# EAGLE design 20130725_Wave_Clock_PIC32MX130_Mono (EAGLE 7.1.0)
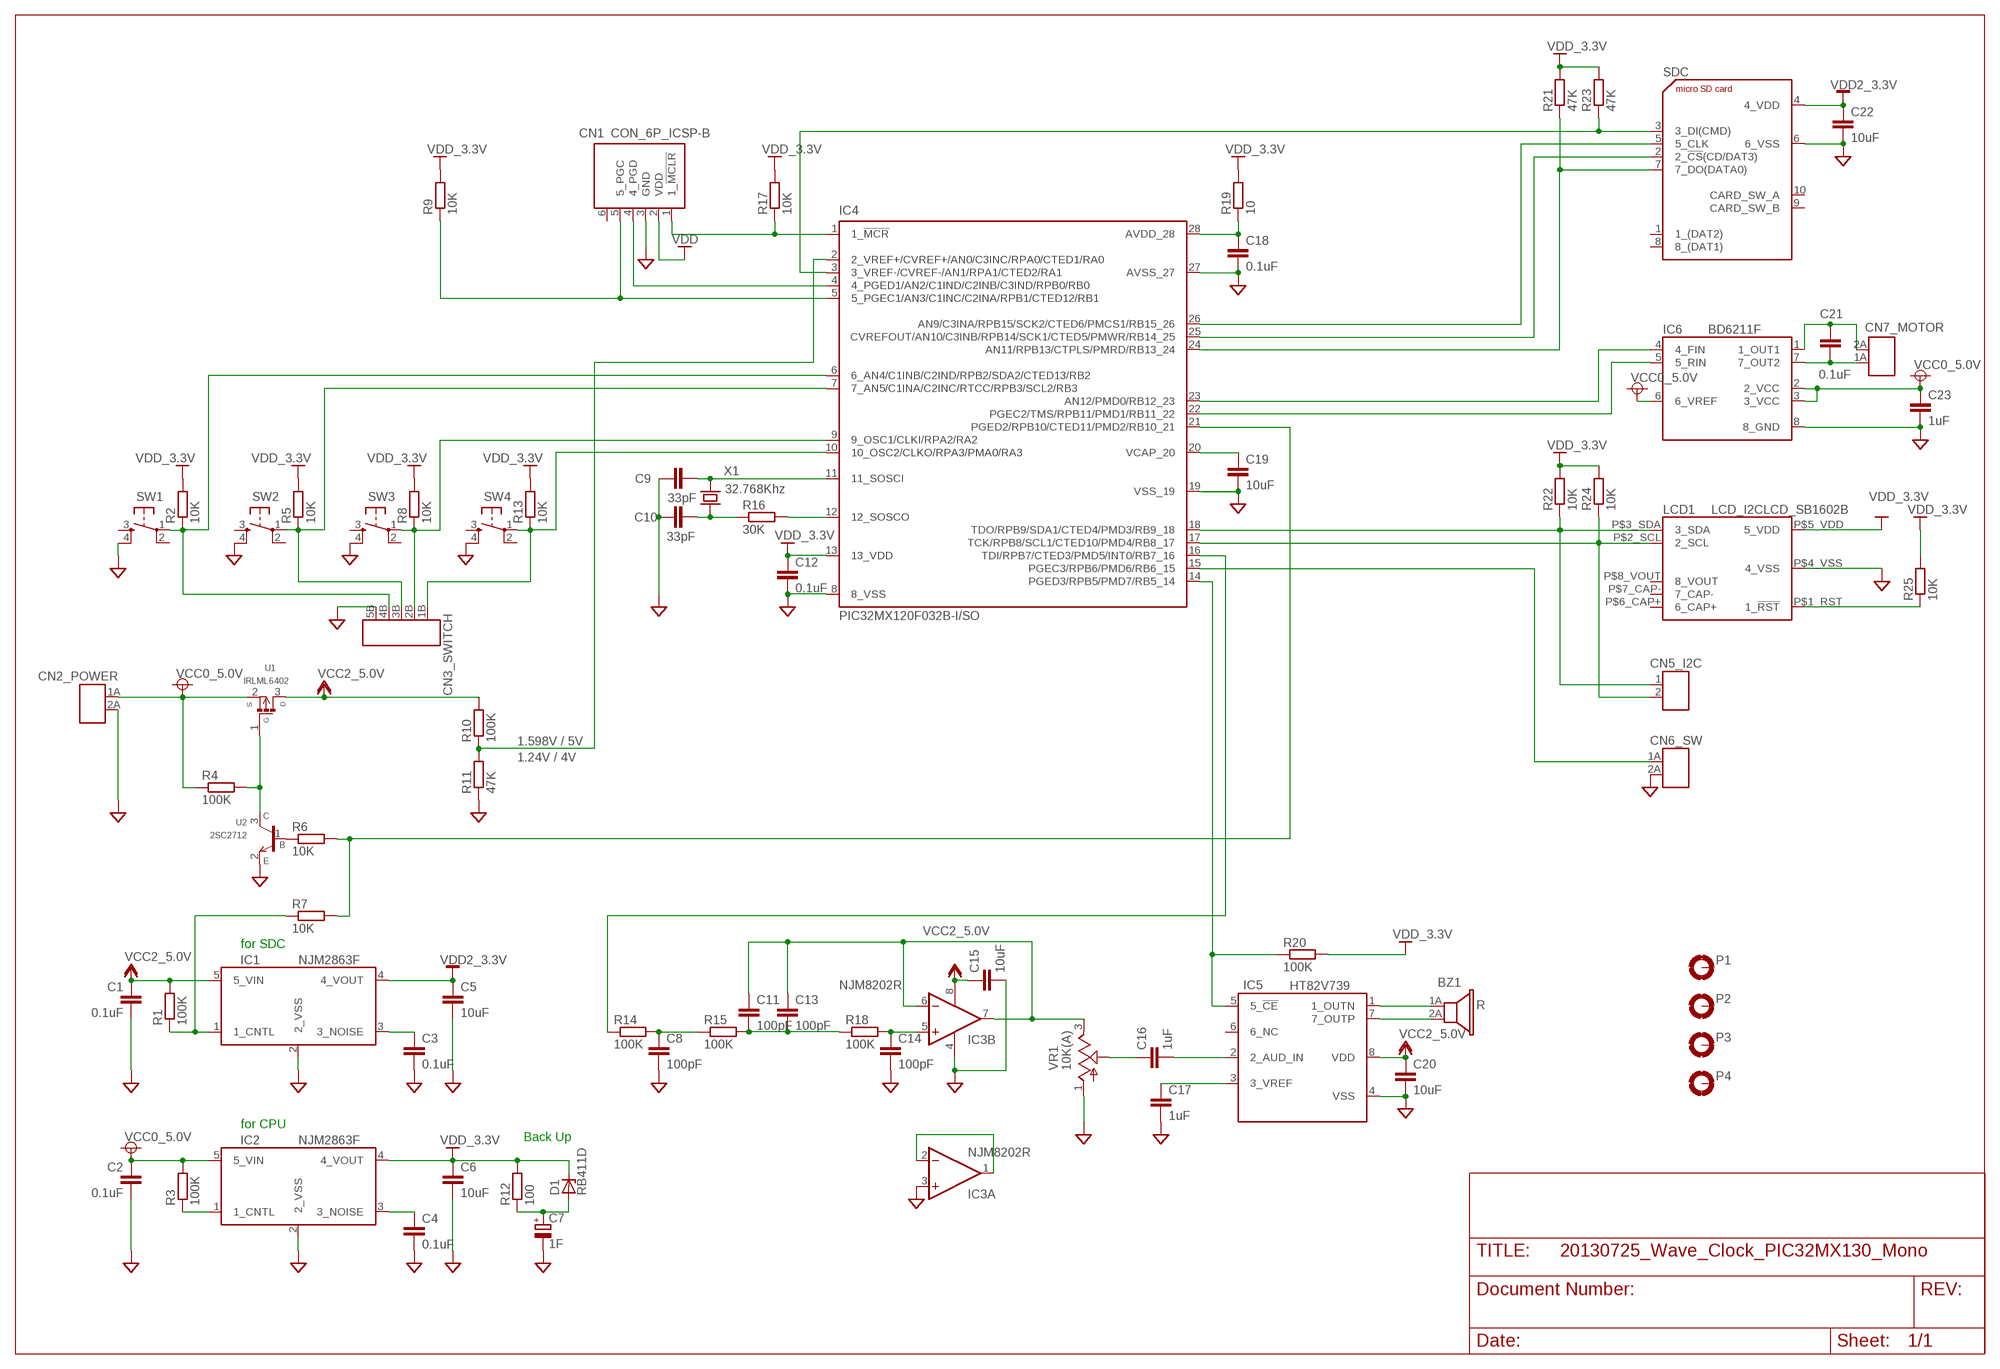
[diagram p0: schematic, sheet 1]

## Parts
BZ1  R  SPEAKER-H  [TERMINAL_AH-2P]
C1  0.1uF  C-EU2M1608  [1608]
C2  0.1uF  C-EU2M1608  [1608]
C3  0.1uF  C-EU2M1608  [1608]
C4  0.1uF  C-EU2M1608  [1608]
C5  10uF  C-EU2M3216  [3216]
C6  10uF  C-EU2M3216  [3216]
C7  1F  CPOL-EDLC-1F5.5V-H  [E5-19V-B]
C8  100pF  C-EU2M1608  [1608]
C9  33pF  C-EU2M1608  [1608]
C10  33pF  C-EU2M1608  [1608]
C11  100pF  C-EU2M1608  [1608]
C12  0.1uF  C-EU2M1608  [1608]
C13  100pF  C-EU2M1608  [1608]
C14  100pF  C-EU2M1608  [1608]
C15  10uF  C-EU2M3216  [3216]
C16  1uF  C-EU2M1608  [1608]
C17  1uF  C-EU2M1608  [1608]
C18  0.1uF  C-EU2M1608  [1608]
C19  10uF  C-EU2M3216  [3216]
C20  10uF  C-EU2M3216  [3216]
C21  0.1uF  C-EU2M1608  [1608]
C22  10uF  C-EU2M3216  [3216]
C23  1uF  C-EU2M1608  [1608]
CN1  CON_6P_ICSP-B  [CON_DIP_6-B]
CN2_POWER  CON_2P-B  CON_2P-H  [TERMINAL_AH-2P]
CN3_SWITCH  CON_5PVR  [TERMINAL_AV-5P]
CN5_I2C  CON_2P-B  [CON_DIP_2-B]
CN6_SW  CON_2P-B  CON_2P-H  [TERMINAL_AH-2P]
CN7_MOTOR  CON_2P-B  CON_2P-H  [TERMINAL_AH-2P]
D1  RB411D  Z_DIODE-SC59  [SOT-23-3-2915-B]
IC1  NJM2863F  [SOT-23-5-2916-B]
IC2  NJM2863F  [SOT-23-5-2916-B]
IC3  NJM8202R  [MSOP08]
IC4  PIC32MX120F032B-I/SO  [SO28W]
IC5  HT82V739  [DIP08-B]
IC6  BD6211F  [SOP8]
LCD1  LCD_I2CLCD_SB1602B  [LCD_SB1602B]
P1  MOUNT-PAD3.3  [PAD-3.3-B]
P2  MOUNT-PAD3.3  [PAD-3.3-B]
P3  MOUNT-PAD3.3  [PAD-3.3-B]
P4  MOUNT-PAD3.3  [PAD-3.3-B]
R1  100K  R-EU2M1608  [1608]
R2  10K  R-EU2M1608  [1608]
R3  100K  R-EU2M1608  [1608]
R4  100K  R-EU2M1608  [1608]
R5  10K  R-EU2M1608  [1608]
R6  10K  R-EU2M1608  [1608]
R7  10K  R-EU2M1608  [1608]
R8  10K  R-EU2M1608  [1608]
R9  10K  R-EU2M1608  [1608]
R10  100K  R-EU2M1608  [1608]
R11  47K  R-EU2M1608  [1608]
R12  100  R-EU2M1608  [1608]
R13  10K  R-EU2M1608  [1608]
R14  100K  R-EU2M1608  [1608]
R15  100K  R-EU2M1608  [1608]
R16  30K  R-EU2M1608  [1608]
R17  10K  R-EU2M1608  [1608]
R18  100K  R-EU2M1608  [1608]
R19  10  R-EU2M1608  [1608]
R20  100K  R-EU2M1608  [1608]
R21  47K  R-EU2M1608  [1608]
R22  10K  R-EU2M1608  [1608]
R23  47K  R-EU2M1608  [1608]
R24  10K  R-EU2M1608  [1608]
R25  10K  R-EU2M1608  [1608]
SDC  DM3AT-SF-PEJＤ  [DM3AT-SF-DIP]
SW1  SW_TACT1  [SW_TACT-B]
SW2  SW_TACT1  [SW_TACT-B]
SW3  SW_TACT1  [SW_TACT-B]
SW4  SW_TACT1  [SW_TACT-B]
U1  IRLML6402  [SC-59-2915]
U2  2SC2712  [SOT-23-3-2915-B]
VR1  10K(A)  POT-VOL  [VOL_MIDDLE]
X1  32.768Khz  XTALVT  [VT-200]

## Nets
GND: C1.2 C2.2 C3.2 C4.2 C5.2 C6.2 C7.- C8.2 C9.2 C10.2 C12.2 C14.2 C15.2 C17.2 C18.2 C19.2 C20.2 C22.2 C23.2 CN1.3(GND) CN2_POWER.2A CN3_SWITCH.5B CN6_SW.2A IC1.2(2_VSS) IC2.2(2_VSS) IC3.3(A:+IN) IC3.4(P:V-) IC4.8(8_VSS) IC4.19(VSS_19) IC4.27(AVSS_27) IC5.4(VSS) IC6.8(8_GND) LCD1.P$4_VSS(4_VSS) R11.1 SDC.6(6_VSS) SW1.4(S1) SW2.4(S1) SW3.4(S1) SW4.4(S1) U2.2(E) VR1.1(A)
N$1: CN1.1(1_!MCLR) IC4.1(1_!MCR) R17.1
N$2: CN1.5(5_PGC) IC4.5(5_PGEC1/AN3/C1INC/C2INA/RPB1/CTED12/RB1) R9.1
N$3: C18.1 IC4.28(AVDD_28) R19.1
N$4: C19.1 IC4.20(VCAP_20)
N$5: IC4.12(12_SOSCO) R16.2
N$6: C9.1 IC4.11(11_SOSCI) X1.P$2
N$7: CN1.4(4_PGD) IC4.4(4_PGED1/AN2/C1IND/C2INB/C3IND/RPB0/RB0)
N$8: CN5_I2C.2 IC4.17(TCK/RPB8/SCL1/CTED10/PMD4/RB8_17) LCD1.P$2_SCL(2_SCL) R24.1
N$9: CN5_I2C.1 IC4.18(TDO/RPB9/SDA1/CTED4/PMD3/RB9_18) LCD1.P$3_SDA(3_SDA) R22.1
N$10: LCD1.P$1_RST(1_!RST) R25.1
N$11: IC4.26(AN9/C3INA/RPB15/SCK2/CTED6/PMCS1/RB15_26) SDC.5(5_CLK)
N$12: IC4.24(AN11/RPB13/CTPLS/PMRD/RB13_24) R21.1 SDC.7(7_DO(DATA0))
N$13: IC4.25(CVREFOUT/AN10/C3INB/RPB14/SCK1/CTED5/PMWR/RB14_25) SDC.2(2_!CS!(CD/DAT3))
N$14: IC4.3(3_VREF-/CVREF-/AN1/RPA1/CTED2/RA1) R23.1 SDC.3(3_DI(CMD))
N$15: CN3_SWITCH.2B IC4.9(9_OSC1/CLKI/RPA2/RA2) R8.1 SW3.1(P)
N$16: IC4.16(TDI/RPB7/CTED3/PMD5/INT0/RB7_16) R14.1
N$18: C14.1 IC3.5(B:+IN) R18.2
N$19: C8.1 R14.2 R15.1
N$20: C11.2 C13.2 R15.2 R18.1
N$25: IC3.1(A:OUT) IC3.2(A:-IN)
N$26: CN6_SW.1A IC4.15(PGEC3/RPB6/PMD6/RB6_15)
N$27: C17.1 IC5.3(3_VREF)
N$28: C16.2 IC5.2(2_AUD_IN)
N$29: BZ1.1A IC5.1(1_OUTN)
N$30: BZ1.2A IC5.7(7_OUTP)
N$31: C10.1 R16.1 X1.P$1
N$32: R6.1 U2.1(B)
N$33: C16.1 VR1.2(S)
N$34: IC1.1(1_CNTL) R1.1 R7.1
N$35: C21.2 CN7_MOTOR.1A IC6.7(7_OUT2)
N$36: C3.1 IC1.3(3_NOISE)
N$37: CN3_SWITCH.3B IC4.7(7_AN5/C1INA/C2INC/RTCC/RPB3/SCL2/RB3) R5.1 SW2.1(P)
N$38: C4.1 IC2.3(3_NOISE)
N$39: IC2.1(1_CNTL) R3.1
N$40: IC4.21(PGED2/RPB10/CTED11/PMD2/RB10_21) R6.2 R7.2
N$41: R4.2 U1.1(G) U2.3(C)
N$42: CN3_SWITCH.4B IC4.6(6_AN4/C1INB/C2IND/RPB2/SDA2/CTED13/RB2) R2.1 SW1.1(P)
N$43: IC4.14(PGED3/RPB5/PMD7/RB5_14) IC5.5(5_!CE) R20.1
N$44: CN3_SWITCH.1B IC4.10(10_OSC2/CLKO/RPA3/PMA0/RA3) R13.1 SW4.1(P)
N$45: C21.1 CN7_MOTOR.2A IC6.1(1_OUT1)
N$49: C11.1 C13.1 IC3.6(B:-IN) IC3.7(B:OUT) VR1.3(E)
N$56: IC4.23(AN12/PMD0/RB12_23) IC6.4(4_FIN)
N$57: IC4.22(PGEC2/TMS/RPB11/PMD1/RB11_22) IC6.5(5_RIN)
N$58: IC4.2(2_VREF+/CVREF+/AN0/C3INC/RPA0/CTED1/RA0) R10.1 R11.2
N$59: C7.+ D1.1(A) R12.1
VCC0: C2.1 C23.1 CN2_POWER.1A IC2.5(5_VIN) IC6.2(2_VCC) IC6.3(3_VCC) IC6.6(6_VREF) R3.2 R4.1 U1.2(S) ; supply symbol labelled VCC0_5.0V
VCC2: C1.1 C15.1 C20.1 IC1.5(5_VIN) IC3.8(P:V+) IC5.8(VDD) R1.2 R10.2 U1.3(D) ; supply symbol labelled VCC2_5.0V
VDD: C6.1 C12.1 CN1.2(VDD) D1.3(C) IC2.4(4_VOUT) IC4.13(13_VDD) LCD1.P$5_VDD(5_VDD) R2.2 R5.2 R8.2 R9.2 R12.2 R13.2 R17.2 R19.2 R20.2 R21.2 R22.2 R23.2 R24.2 R25.2 ; supply symbol labelled VDD_3.3V
VDD2: C5.1 C22.1 IC1.4(4_VOUT) SDC.4(4_VDD) ; supply symbol labelled VDD2_3.3V
Unconnected: CN1.6 IC5.6(6_NC) LCD1.P$6_CAP+(6_CAP+) LCD1.P$7_CAP-(7_CAP-) LCD1.P$8_VOUT(8_VOUT) P1.B2,1(MOUNT) P2.B2,1(MOUNT) P3.B2,1(MOUNT) P4.B2,1(MOUNT) SDC.1(1_(DAT2)) SDC.8(8_(DAT1)) SDC.9(CARD_SW_B) SDC.10(CARD_SW_A) SW1.2(P1) SW1.3(S) SW2.2(P1) SW2.3(S) SW3.2(P1) SW3.3(S) SW4.2(P1) SW4.3(S)

## Notes on the sheet
- 1.598V / 5V
- 1.24V / 4V
- for SDC
- for CPU
- Back Up

## Library data of the parts
BZ1 = p20130601_WaveClock_Pic32MX120:SPEAKER: Speaker
C1-C6 C8-C23 = p20130601_WaveClock_Pic32MX120:C-EU2: CAPACITOR, European symbol
C7 = p20130601_WaveClock_Pic32MX120:CPOL-EDLC: ELNA Electric Double Layer Capacitor DB-5R5D473 T <http://akizukidenshi.com/download/DB-5R5D105T.pdf> 0.047uF 5.5WV
CN1 = p20130601_WaveClock_Pic32MX120:CON_6P_ICSP
CN2_POWER CN5_I2C CN6_SW CN7_MOTOR = p20130601_WaveClock_Pic32MX120:CON_2P: 2P Molex Connector
CN3_SWITCH = p20130601_WaveClock_Pic32MX120:CON_5P
D1 = p20130601_WaveClock_Pic32MX120:Z_DIODE: Z DIODE
IC1 IC2 = p20130601_WaveClock_Pic32MX120:NJM2863: NJM 3.3V series regulator Data Sheet <http://datasheet.sii-ic.com/jp/voltage_regulator/S812C_J.pdf>
IC3 = p20130601_WaveClock_Pic32MX120:NJM8202: OP AMP
IC4 = p20130601_WaveClock_Pic32MX120:PIC32MX120F032B-I/: PIC32MX120 Family Source: Data sheet <http://ww1.microchip.com/downloads/en/DeviceDoc/61168E.pdf>
IC5 = p20130601_WaveClock_Pic32MX120:HT82V739
IC6 = p20130601_WaveClock_Pic32MX120:BD6211: ROHM H-bridge Motor Driver (7V max.) These H-bridge drivers are full bridge drivers for brush motor applications.
LCD1 = p20130601_WaveClock_Pic32MX120:LCD_I2CLCD
P1-P4 = p20130601_WaveClock_Pic32MX120:MOUNT-PAD: 2.1mm Mount Pad (Connectable to GND)
R1-R25 = p20130601_WaveClock_Pic32MX120:R-EU2: RESISTOR, European symbol
SDC = p20130601_WaveClock_Pic32MX120:DM3AT-SF-PEJ: DM3AT-SF-PEJ DM3AT series , microSD card socket Producted by Hirose(HRS).Co CC : card check (closed at insert ; short CC1 and CC2)
SW1-SW4 = p20130601_WaveClock_Pic32MX120:SW_TACT: Tacticle Push Switch
U1 = p20130601_WaveClock_Pic32MX120:IRLML6402: International Rectifier Field Effect Transistor Silicon P Channel MOS IRLML64026402 <http://www.irf.com/product-info/datasheets/data/irlml6402.pdf> VDS=-20V RON=50m¶(VGS=-4.5V) ID=-3.7A
U2 = p20130601_WaveClock_Pic32MX120:2SC2712: TOSHIBA Silicon NPN Tripple Siffused Type ( PCT process) High Voltage Control Applications 2SC2712 <http://www.toshiba.com/taec/components2/Datasheet_Sync/50/6545.pdf> VCEO=50V IC=100mA hFE=120-240
VR1 = p20130601_WaveClock_Pic32MX120:POT: Volume Trimmer Resister
X1 = p20130601_WaveClock_Pic32MX120:XTAL: Crystal Oscillator HC49U/S

## Net classes
1 VCC0: width 0.762 mm
2 VCC2: width 0.508 mm
3 VDD0: width 0.508 mm
4 VDD2: width 0.508 mm

## Board
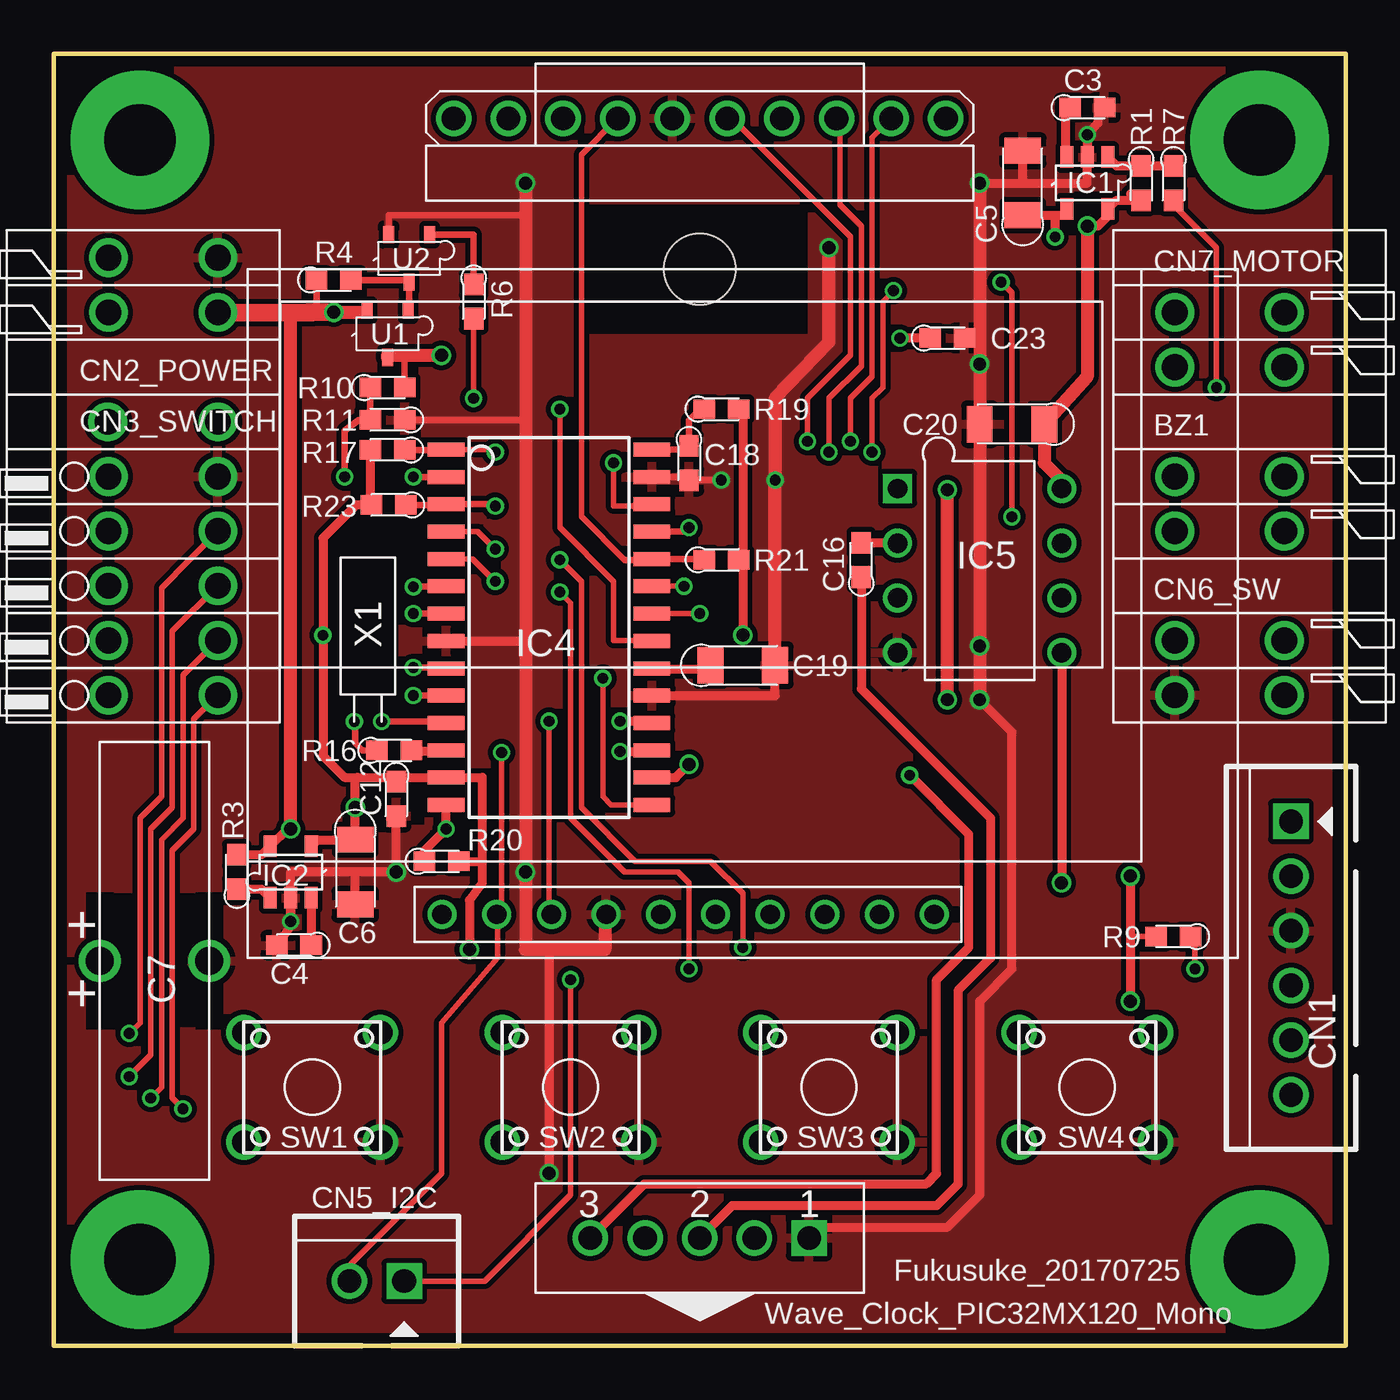
[diagram p1: board, top side]
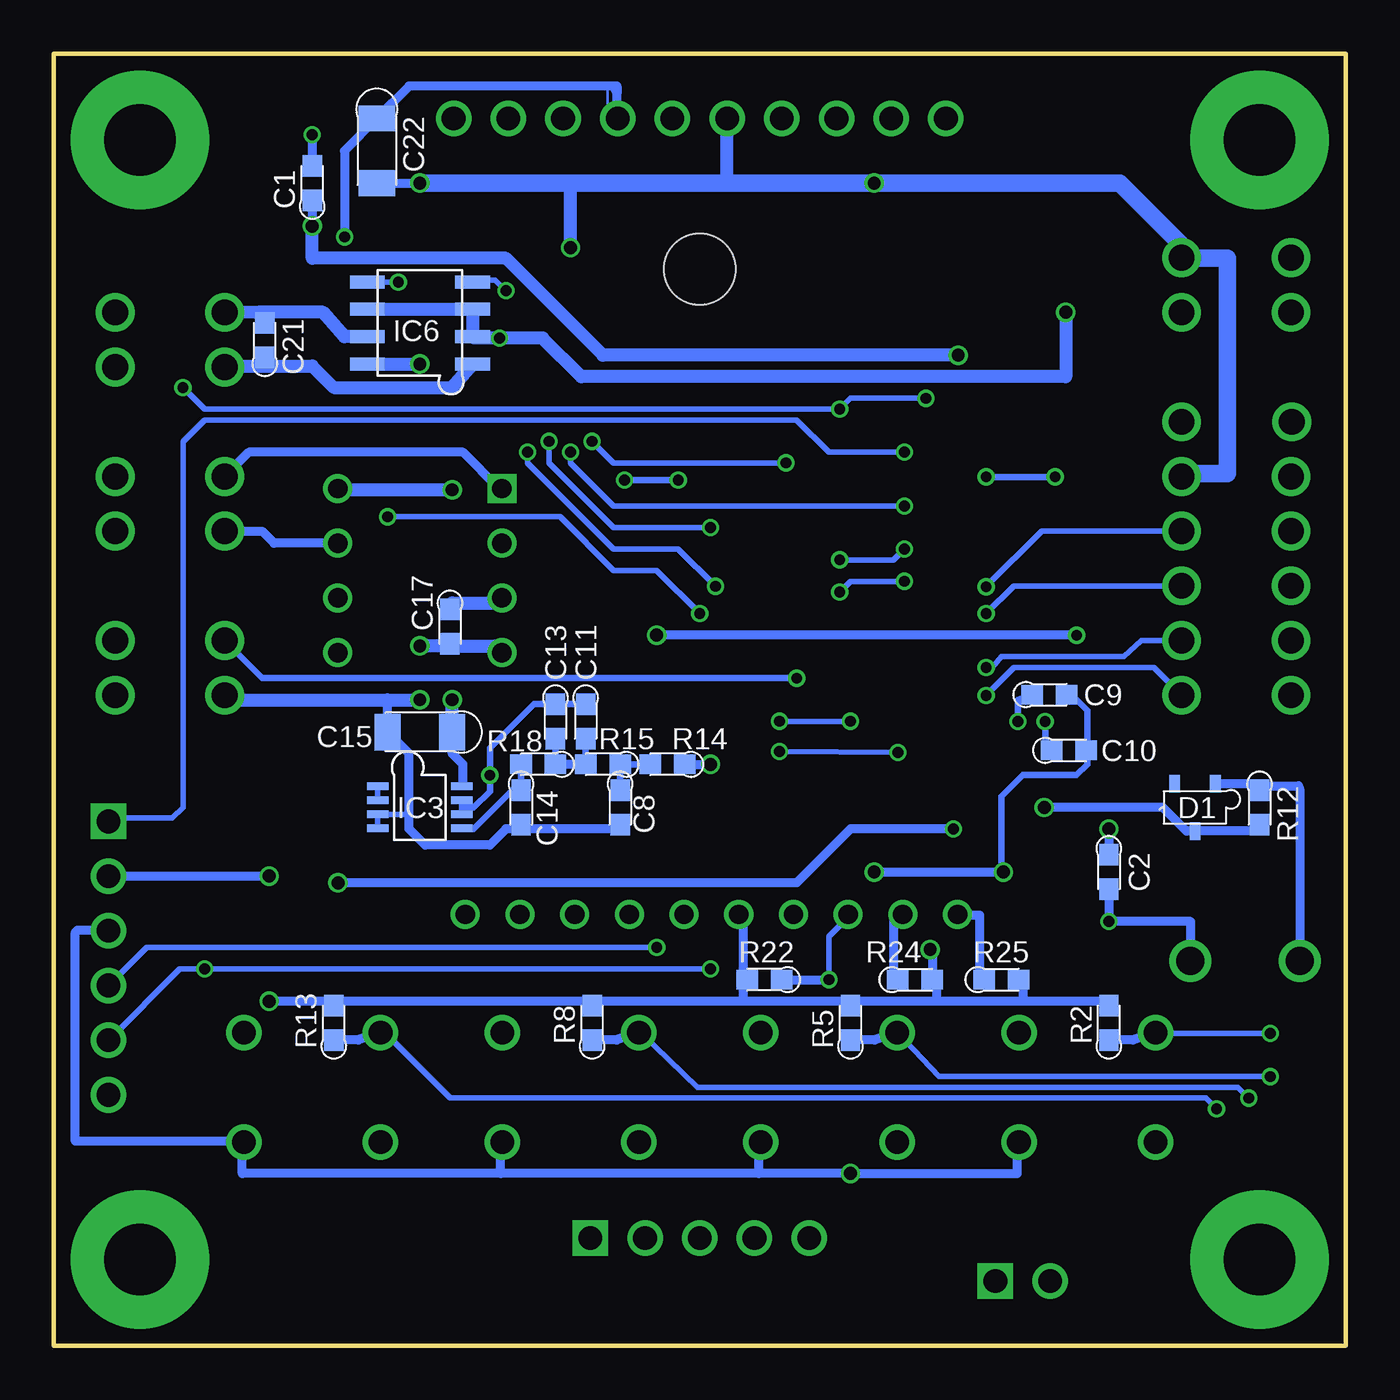
[diagram p2: board, bottom side, seen from below]

Size 60 x 60 mm. Coordinates in mm from the lower left corner, seen from the top.
Outline: 0,0 60,0 60,60 0,60 0,0
Copper layers (1*16): Top 0.035mm / dielectric 1.53mm / Bottom 0.035mm
Design rules "pban_5mil-l2 *": minimum track width 5mil, minimum drill 0.3mm, track to track 0.229mm, track to pad 0.229mm, pad to pad 0.229mm, via to via 0.229mm, smd to smd 5mil, copper to edge 0.5mm, drill to drill 0.5mm, minimum pad ring 0.15mm, minimum via ring 0.15mm, stop-mask expansion 4mil, vias tented up to drill 0.35mm, thermal gap 10mil
Holes 3.3 mm at 30,50
tRestrict: area 25,47 to 35,53; area 13,30 to 16,37; area 15.1,51.2 to 15.3,52; area 15.1,51 to 16,51.2; area 15.8,51.2 to 16,52; area 14.5,24.2 to 15.4,26; area 16.6,24.2 to 17.2,26; area 3.2,15.2 to 3.6,21; area 5.8,14.8 to 6.2,21; area 2.8,18.8 to 3.2,21; area 6.2,18.8 to 6.6,21; area 6.2,14.8 to 6.6,17; 4 more areas
bRestrict: area 27,47 to 33,53

### Footprints (pad centres in the part's own frame; a part is rotated, then mirrored left to right if it is on the bottom)
TERMINAL_AH-2P = drill 1.2: 1A 0,0; 1B 0,5.08; 2A 2.54,0; 2B 2.54,5.08
1608 = smd 1 x 0.9: 1 -0.8,0; 2 0.8,0
3216 = smd 1.2 x 1.7: 1 -1.5,0; 2 1.5,0
E5-19V-B = drill 1.3: + 0,2.54; - 0,-2.54
CON_DIP_6-B = drill 1.1 square: 1 -6.35,0 | drill 1.1: 2 -3.81,0; 3 -1.27,0; 4 1.27,0; 5 3.81,0; 6 6.35,0
TERMINAL_AV-5P = drill 1.2: 1A 0,5.08; 1B 0,0; 2A 2.54,5.08; 2B 2.54,0; 3A 5.08,5.08; 3B 5.08,0; 4A 7.62,5.08; 4B 7.62,0; 5A 10.16,5.08; 5B 10.16,0
CON_DIP_2-B = drill 1.1 square: 1 -1.27,0 | drill 1.1: 2 1.27,0
SOT-23-3-2915-B = smd 0.5 x 0.8: 1 -0.95,-1.1; 2 0.95,-1.1; 3 0,1.1
SOT-23-5-2916-B = smd 0.6 x 1: 1 -0.95,-1.2; 2 0,-1.2; 3 0.95,-1.2; 4 0.95,1.2; 5 -0.95,1.2
MSOP08 = smd 0.35 x 1: 1 -0.975,-1.95; 2 -0.325,-1.95; 3 0.325,-1.95; 4 0.975,-1.95; 5 0.975,1.95; 6 0.325,1.95; 7 -0.325,1.95; 8 -0.975,1.95
SO28W = smd 0.65 x 1.7: 1 -7.62,-4.78; 2 -6.35,-4.78; 3 -5.08,-4.78; 4 -3.81,-4.78; 5 -2.54,-4.78; 6 -1.27,-4.78; 7 0,-4.78; 8 1.27,-4.78; 9 2.54,-4.78; 10 3.81,-4.78; 11 5.08,-4.78; 12 6.35,-4.78; 13 7.62,-4.78; 14 8.89,-4.78; 15 8.89,4.78; 16 7.62,4.78; 17 6.35,4.78; 18 5.08,4.78; 19 3.81,4.78; 20 2.54,4.78; 21 1.27,4.78; 22 0,4.78; 23 -1.27,4.78; 24 -2.54,4.78; 25 -3.81,4.78; 26 -5.08,4.78; 27 -6.35,4.78; 28 -7.62,4.78
DIP08-B = drill 0.9 square: 1 -3.81,-3.81 | drill 0.9: 2 -1.27,-3.81; 3 1.27,-3.81; 4 3.81,-3.81; 5 3.81,3.81; 6 1.27,3.81; 7 -1.27,3.81; 8 -3.81,3.81
SOP8 = smd 0.6 x 1.62: 1 -1.905,-2.44; 2 -0.635,-2.44; 3 0.635,-2.44; 4 1.905,-2.44; 5 1.905,2.44; 6 0.635,2.44; 7 -0.635,2.44; 8 -1.905,2.44
LCD_SB1602B = drill 0.9: P$1_RST -13.97,-13.97; P$2_SCL -11.43,-13.97; P$3_SDA -8.89,-13.97; P$4_VSS -6.35,-13.97; P$5_VDD -3.81,-13.97; P$6_CAP+ -1.27,-13.97; P$7_CAP- 1.27,-13.97; P$8_VOUT 3.81,-13.97; P$9_LED_A 6.35,-13.97; P$10_LED_K 8.89,-13.97
PAD-3.3-B = drill 3.3 pad 6.452: B2,1 0,0
DM3AT-SF-DIP = drill 1.1: 1 11.43,0; 2 8.89,0; 3 6.35,0; 4 3.81,0; 5 1.27,0; 6 -1.27,0; 7 -3.81,0; 8 -6.35,0; 9 -8.89,0; 10 -11.43,0
SW_TACT-B = drill 1.1: 1 -3.175,2.54; 2 3.175,2.54; 3 -3.175,-2.54; 4 3.175,-2.54
SC-59-2915 = smd 0.5 x 0.8: 1 -0.95,-1.1; 2 0.95,-1.1; 3 0,1.1
VOL_MIDDLE = drill 1.1 square: 1 -5.08,0 | drill 1.1: 2 0,0; 3 5.08,0; NC4 -2.54,0; NC5 2.54,0
VT-200 = drill 0.5: P$1 -0.635,-4.445; P$2 0.635,-4.445

### Placement (x,y rotation side)
BZ1  52.07,40.37 270 top
C1  48,54 90 bottom
C2  11,22 270 bottom
C3  48,57.5 0 top
C4  11.15,18.6 180 top
C5  45,54 90 top
C6  14,22 270 top
C7  4.68,17.87 90 top
C8  33.7,25 270 bottom
C9  13.77,30.24 0 bottom
C10  12.86,27.65 0 bottom
C11  35.3,29 270 bottom
C12  15.9,25.4 270 top
C13  36.7,29 270 bottom
C14  38.3,25 270 bottom
C15  43,28.5 180 bottom
C16  37.5,36.5 90 top
C17  41.6,33.4 270 bottom
C18  29.5,41 270 top
C19  32,31.6 0 top
C20  44.5,42.8 180 top
C21  50.2,46.7 90 bottom
C22  45,55.5 270 bottom
C23  41.5,46.8 0 top
CN1  57.46,18 270 top
CN2_POWER  7.62,47.99 90 top
CN3_SWITCH  7.62,30.21 90 top
CN5_I2C  15,3 180 top
CN6_SW  52.07,32.75 270 top
CN7_MOTOR  52.07,47.99 270 top
D1  7,25 180 bottom
IC1  48,54 180 top
IC2  11,22 0 top
IC3  43,25 270 bottom
IC4  23,34 270 top
IC5  43,36 270 top
IC6  43,47.5 90 bottom
LCD1  32,34 0 top
P1  4,4 0 top
P2  56,4 0 top
P3  56,56 0 top
P4  4,56 0 top
R1  50.5,54 270 top
R2  11,15 90 bottom
R3  8.5,22 90 top
R4  13,49.5 0 top
R5  23,15 90 bottom
R6  19.5,48.5 270 top
R7  52,54 270 top
R8  35,15 90 bottom
R9  52,19 180 top
R10  15.5,44.5 0 top
R11  15.5,43 180 top
R12  4,25 270 bottom
R13  47,15 90 bottom
R14  31.5,27 180 bottom
R15  34.5,27 180 bottom
R16  15.8,27.65 0 top
R17  15.5,41.6 180 top
R18  37.5,27 180 bottom
R19  31,43.5 0 top
R20  18,22.5 0 top
R21  31,36.5 0 top
R22  27,17 180 bottom
R23  15.55,39.05 180 top
R24  20,17 0 bottom
R25  16,17 0 bottom
SDC  30,57 0 top
SW1  12,12 0 top
SW2  24,12 0 top
SW3  36,12 0 top
SW4  48,12 0 top
U1  15.5,47 180 top
U2  16.5,50.5 180 top
VR1  30,5 180 top
X1  14.59,33.43 0 top

### Tracks (layer width: path | path; a pad name or v marks a point on that pad's centre or on a via)
GND  (via drill 0.5, 0.6)
  Top 0.305: v31,40.2 C18.2 29.35,40.35 IC4.27 | U2.2 15.55,52.5 21.9,52.5 | R11.1 21.9,43
  Top 0.406: 48,56.2 IC1.2 | C22.2 48,54 48,55 | v48,56.25 48.5,56.8 48.5,57.5 C3.2 | v43,54 C22.2 | C22.2 C5.2 | 21.9,32.7 18.3,32.7 | 23,18.4 v23,8 | 25.6,20 LCD1.P$4_VSS | IC2.2 v11,19.7 | v11,19.7 11,19.5 C4.2 | C6.2 14,22 | 14,22 11,22 v11,19.7 | 14,22 v15.9,22 C12.2 | C23.2 42.7,46.8 43,46.5 | VR1.1 35.08,5.08 35.5,5.5 41.5,5.5 43,7 43,16 44.5,17.5 C15.2 v43,30 | IC4.19 33.5,30.19 C19.2
  Top 0.61: v43,54 43,46.5 v43,45.59 C20.2 v43,32.5 v43,30 | v36,51 36,46.6 33.5,44 v33.5,40.2 C19.2 | v21.9,54 21.9,52.5 21.9,43 21.9,32.7 v21.9,22 21.9,18.4 23,18.4 25.6,18.4 25.6,20
  Bottom 0.254: IC3.4 IC3.3 43.5,24.68 43.5,24.5
  Bottom 0.305: v31,40.2 v33.5,40.2 | 12,27.65 12,27 12.5,26.5 15,26.5 16,25.5 16,22.1 | C9.2 12.74,30.24 12,29.5 12,27.71 C10.2
  Bottom 0.406: 7.7,50.5 CN2_POWER.2A | 28.75,56.9 SDC.6 | v48,56.25 C1.2 | 41.5,32.5 C17.2 | 52,30 CN6_SW.2A | C14.2 38.3,24 | 27.25,8 v23,8 15.25,8 15.25,9.25 SW1.4 | 27.25,8 39.25,8 | 39.25,8 51.25,8 51.25,9.5 | 27.25,8 27.25,9.25 SW2.4 | 39.25,8 39.25,9.25 SW3.4 | 51.25,9.5 SW4.4 | C2.2 v11,19.7 7.2,19.7 7.2,17.89 C7.- | 22,22 v15.9,22 16,22.1 | 33.7,24.1 C8.2 33.8,24.2 34,24 38.1,24 C14.2 | 44.5,30 C15.2 43.5,27.5 43.5,24.5 43.5,24 42.75,23.25 39.75,23.25 39,24 38.5,24 C14.2 | 51.25,9.5 59,9.5 59,19.2 58.9,19.3 57.49,19.3 CN1.3 | C10.2 12,27.65 | C22.2 v43,54
  Bottom 0.61: 28.75,56.9 28.75,54 | v36,51 36,54 | v43,32.5 41.5,32.5 39.5,32.5 IC5.4 | 52,30 44.5,30 v43,30 | IC6.8 v43,45.59
  Bottom 0.813: v43,54 36,54 28.75,54 v21.9,54 10.5,54 7.7,51.2 7.7,50.5 5.5,50.5 5.5,40.5 7.62,40.5 CN3_SWITCH.5B
  pour Top: 0,60 60,60 60,0 0,0
N$1  (via drill 0.5)
  Top 0.254: IC4.1 20.38,41.62 v20.5,41.5
  Top 0.305: R17.1 18.2,41.6 IC4.1
  Bottom 0.254: v20.5,41.5 24,41.5 25.5,43 53,43 54,42 54,25 54.5,24.5 57.31,24.5 CN1.1
N$2  (via drill 0.5)
  Top 0.254: IC4.5 19.46,36.54 v20.5,35.5 | v23.5,35 24,34.5 24,24.5 26.5,22 29,22 29.5,21.5 v29.5,17.5 | R9.1 53,19 v53,17.5
  Bottom 0.254: v20.5,35.5 23,35.5 v23.5,35 | v29.5,17.5 v53,17.5 54.15,17.5 CN1.5
N$3
  Top 0.305: 29.3,41.62 IC4.28 | R19.1 30,43.5 29.5,43 C18.1
  Top 0.406: 29.3,41.62 C18.1
N$4
  Top 0.406: IC4.20 27.8,31.4 30.6,31.4 30.6,31.6 C19.1
N$5
  Top 0.406: R16.2 16.6,27.6 18.2,27.6 IC4.12
N$6
  Top 0.305: X1.P$2 15.4,29 18.2,29
  Top 0.406: 18.2,29 IC4.11
  Bottom 0.305: C9.1 15.22,30 X1.P$2
N$7  (via drill 0.5)
  Top 0.254: IC4.4 19.69,37.81 v20.5,37 | v23.5,36.5 24.5,35.5 24.5,25 27,22.5 30.5,22.5 32,21 v32,18.5
  Bottom 0.254: v20.5,37 21,36.5 v23.5,36.5 | v32,18.5 55.69,18.5 CN1.4
N$8  (via drill 0.5)
  Top 0.254: v20.8,27.55 20.8,20.65 20.6,20.45 20.6,20.1 20.6,18 18,15 18,8 13.8,3.8 CN5_I2C.2 | IC4.17 27.78,27.62 27.8,27.6
  Top 0.406: v26.3,27.6 27.8,27.6 | 20.6,20.1 LCD1.P$2_SCL
  Bottom 0.254: v20.8,27.55 v26.3,27.6
  Bottom 0.406: LCD1.P$2_SCL 21,20 21,17 R24.1
N$9  (via drill 0.5)
  Top 0.254: 23,20 v23,29 | v24,17 24,7 20,3 CN5_I2C.1
  Top 0.406: 23,20 LCD1.P$3_SDA | v26.3,29 27,29 IC4.18
  Bottom 0.254: v24,17 24,19 23,20 | v23,29 v26.3,29
  Bottom 0.406: 23,20 LCD1.P$3_SDA | R22.1 v24,17
N$10
  Bottom 0.406: LCD1.P$1_RST 18,20 17,20 17,17 R25.1
N$11  (via drill 0.5)
  Top 0.254: 26.92,39 26,39 v26,41 | v35,42 35,44 37,46 37,51.5 32,56.5
  Top 0.305: IC4.26 26.92,39 | 32,56.5 31.5,57 SDC.5
  Bottom 0.254: v26,41 34,41 v35,42
N$12
  Top 0.254: 26.5,36.5 24.5,38.5 24.5,55.31 SDC.7
  Top 0.305: R21.1 30.2,36.54 IC4.24 27.5,36.5 26.5,36.5
N$13  (via drill 0.5)
  Top 0.254: v37,42 37,44 38,45 38,56.11 SDC.2
  Top 0.305: IC4.25 29.31,37.81 v29.5,38
  Bottom 0.254: v29.5,38 34,38 37,41 v37,42
N$14  (via drill 0.5)
  Top 0.254: v36,41.5 36,44 37.5,45.5 37.5,52 36.5,53 36.5,56.85
  Top 0.305: R23.1 18.19,39.05 IC4.3 20.42,39.08 v20.5,39 | 36.5,56.85 SDC.3
  Bottom 0.254: v20.5,39 34,39 36,41 v36,41.5
N$15  (via drill 0.5)
  Top 0.254: CN3_SWITCH.2B 6,31.15 6,24.5 5,23.5 5,12 v4.5,11.5
  Top 0.305: v16.7,31.5 18.18,31.5 IC4.9
  Bottom 0.254: 32.74,14.54 30.1,12 5,12 v4.5,11.5 | CN3_SWITCH.2B 9.5,32.75 10.3,32 16,32 16.4,31.5 v16.7,31.5
  Bottom 0.305: SW3.1 32.74,14.54
  Bottom 0.406: SW3.1 33.87,14.2 R8.1
N$16  (via drill 0.6)
  Top 0.406: IC4.16 28.88,26.38 v29.5,27
  Bottom 0.406: R14.1 v29.5,27
N$17  (via drill 1.2)
  other vias: 7.62,42.91
N$18
  Bottom 0.305: R18.2 C14.1 38.7,25.8 40.5,24 41.02,24 IC3.5
N$19
  Bottom 0.305: R14.2 R15.1 C8.1
N$20
  Bottom 0.305: C11.2 R15.2 | C13.2 R18.1
  Bottom 0.406: R15.2 R18.1
N$21  (via drill 1.2)
  other vias: 2.5,42.91
N$25
  Bottom 0.254: IC3.2 IC3.1
N$26  (via drill 0.5)
  Top 0.254: IC4.15 25.89,25.11 25.5,25.5 v25.5,31
  Bottom 0.305: v25.5,31 50.32,31 CN6_SW.1A
N$27
  Bottom 0.406: 41.5,34.5 C17.1
  Bottom 0.61: 41.5,34.5 39.5,34.5 IC5.3
N$28
  Top 0.406: C16.2 39.16,37.3 IC5.2
N$29
  Bottom 0.406: IC5.1 39.31,39.81 41,41.5 50.94,41.5 BZ1.1A
N$30
  Bottom 0.406: IC5.7 49.77,37.27 50.33,37.83 BZ1.2A
N$31
  Top 0.305: R16.1 14.35,27.65 14,28 14,28.94
  Top 0.406: 14,28.94 X1.P$1
  Bottom 0.305: X1.P$1 13.96,27.95
  Bottom 0.406: 13.96,27.95 C10.1
N$32
  Top 0.305: U2.1 19.5,51.6 R6.1
N$33
  Top 0.406: C16.1 37.5,30.5 43.5,24.5 43.5,18 42,16.5 42,7.5 41,6.5 31.5,6.5 VR1.2
N$34
  Top 0.406: 49,55.5 IC1.1 49.35,54.8 R1.1 R7.1
N$35
  Bottom 0.61: IC6.7 46.5,46.87 47.5,48 50.5,47.99 | 50.5,47.99 CN7_MOTOR.1A | C21.2 50.5,47.99
N$36
  Top 0.406: C3.1 47,57 47,55.5 IC1.3
N$37  (via drill 0.5)
  Top 0.254: CN3_SWITCH.3B 5.5,33.2 5.5,25 4.5,24 4.5,13.5 v3.5,12.5
  Top 0.305: v16.7,34 IC4.7
  Bottom 0.254: v3.5,12.5 18.89,12.5 SW2.1 | CN3_SWITCH.3B 15.4,35.29 v16.7,34
  Bottom 0.406: SW2.1 21.86,14.2 R5.1
N$38
  Top 0.406: IC2.3 C4.1
N$39
  Top 0.406: IC2.1 9.65,21.2 R3.1
N$40  (via drill 0.5)
  Top 0.254: R6.2 v19.5,44 | v23.5,43.5 23.5,38 26,35.5 26,32.75 27.76,32.75 | v54,44.5 54,51 52,53 R7.2
  Top 0.305: 27.76,32.75 IC4.21
  Bottom 0.254: v19.5,44 23,44 v23.5,43.5 53,43.5 v54,44.5
N$41
  Top 0.305: R4.2 16.4,49.5 U2.3 16.5,48.15 U1.1
N$42  (via drill 0.5)
  Top 0.254: CN3_SWITCH.4B 5,35.2 5,25.5 4,24.5 4,15 v3.5,14.5
  Top 0.305: v16.7,35.25 18.2,35.25 IC4.6
  Bottom 0.254: v3.5,14.5 8.03,14.5 SW1.1 | CN3_SWITCH.4B 14.1,37.83 v16.7,35.25
  Bottom 0.406: SW1.1 9.87,14.2 R2.1
N$43  (via drill 0.5, 0.6)
  Top 0.406: IC5.5 v46.81,21.51 v46.8,21.5 | R20.1 17.2,22.98 v18.22,24 IC4.14
  Bottom 0.406: v18.22,24 23,24 25.5,21.5 v46.8,21.5
N$44  (via drill 0.5)
  Top 0.254: CN3_SWITCH.1B 6.5,29.1 6.5,24 5.5,23 5.5,11.5 v6,11
  Top 0.305: IC4.10 16.81,30.19 v16.7,30.2
  Bottom 0.254: 44.64,14.54 41.6,11.5 6.5,11.5 v6,11 | v16.7,30.2 15.4,31.5 8.91,31.5 CN3_SWITCH.1B
  Bottom 0.305: SW4.1 44.64,14.54 | CN3_SWITCH.1B
  Bottom 0.406: SW4.1 45.87,14.2 R13.1
N$45
  Bottom 0.61: CN7_MOTOR.2A 51.5,45.5 50,45.5 | 50,45.5 48,45.5 47,44.5 41.5,44.5 IC6.1 | C21.1 50,45.5
N$49  (via drill 0.5)
  Top 0.406: v39.75,26.5 42.5,23.75 42.5,18.5 41,17 41,8 40.5,7.5 27.42,7.5 VR1.3
  Bottom 0.305: C11.1 C13.1 37.7,29.8 39.75,27.75 v39.75,26.5 39.75,25.75 40.5,25 40.92,25 IC3.6 IC3.7
N$56  (via drill 0.5)
  Top 0.254: v38,41.5 38,44 38.5,44.5 38.5,48.5 v39,49 | IC4.23 v29.27,35.27
  Bottom 0.254: v38,41.5 38,41 34,37 31,37 v29.27,35.27 | v39,49 39.5,49.5 40.47,49.5 IC6.4
N$57  (via drill 0.5)
  Top 0.254: IC4.22 v30,34 | v44.5,38.5 44.5,48.9 v44,49.4
  Bottom 0.254: v30,34 32,36 34,36 36.5,38.5 v44.5,38.5 | IC6.5 44.59,49.41 v44,49.4
N$58  (via drill 0.5)
  Top 0.305: R10.1 R11.2 14.15,43 13.5,42.5 v13.5,40.35 | v16.7,40.35 IC4.2
  Bottom 0.305: v13.5,40.35 v16.7,40.35
N$59
  Bottom 0.406: D1.1 4.3,26.1 R12.1 3.8,26 2.2,26 2.14,25.86 C7.+
VCC0  (via drill 0.5, 0.6)
  Top 0.305: R4.1 12.2,48.19 12,47.99
  Top 0.406: 10.85,24 IC2.5 9.65,22.8 R3.2 | 10.85,24 v11,24 | 10.85,24 11,24.15 | 11,48 10.99,47.99 | C23.1 v39.3,46.8 | 14.44,47.99 U1.2
  Top 0.61: 11,24.15 11,48 | 14.44,47.99 v13,47.99 v13,48 | 11.8,48 11.8,47.99
  Top 0.813: CN2_POWER.1A 10.99,47.99 11.8,47.99 12,47.99 | v13,48 11.8,48
  Bottom 0.406: v11,24 C2.1
  Bottom 0.61: IC6.6 IC6.3 IC6.2 40.5,46.8 v39.3,46.8 37.3,46.8 35.5,45 13,45 v13,48
VCC2  (via drill 0.6)
  Top 0.305: U1.3 16.3,45.9 R10.2
  Top 0.406: v48,52 48.5,52 49,52.5 IC1.5 49.35,53.2 R1.2 50,53.5 | 17.95,46.1 v18,46 17.9,46
  Top 0.61: v48,52 48,45 C20.1 46,41 46.81,40.19 IC5.8 | v41.5,30 v41.5,39.75 | 17.9,46 15.5,46 U1.3
  Bottom 0.254: 41,26 41.02,26 IC3.8
  Bottom 0.406: v48,52 C1.1 48,53.5 | 41,26 41,27 41.5,27.5 C15.1
  Bottom 0.61: v18,46 34.5,46 39,50.5 48,50.5 v48,52 | C15.1 v41.5,30 | v41.5,39.75 46.5,39.75 IC5.8
VDD  (via drill 0.5, 0.6)
  Top 0.254: 14.7,39.1 R23.2 | R9.2 50,19
  Top 0.305: 31.5,36.5 R21.2
  Top 0.406: IC2.4 12.25,23.5 C6.1 v14,25 14,26.3 14.1,26.4 | 19.9,22.5 19.9,26.4 18.24,26.4 IC4.13 16.08,26.38 C12.1 15.7,26.4 14.1,26.4 | 19.9,22.5 19.9,21.5 19.3,20.7 v19.3,18.4 | v50,21.81 50,19 v50,16 | R20.2 19.9,22.5 | R23.2 14.05,39.05 12.5,37.5 v12.5,33 12.5,27.4 13.5,26.4 14.1,26.4 | R17.2 14.7,39.1 | R19.2 32,43.25 32,36.6 R21.2 | 32,36.5 v32,33
  Top 0.61: 32,36.5 R21.2
  Bottom 0.406: 15,16 11,16 R2.2 | 15,16 19,16 | 19,16 23,16 | 23,16 28,16 | 28,16 35,16 | 35,16 47,16 | 47,16 v50,16 | 23,16 R5.2 23,15.7 | 15,16 15,17 R25.2 | 19,16 19,17 R24.2 19.2,18.3 v19.3,18.4 | 28,17 28,16 | 35,16 R8.2 | 28,17 R22.2 | 28,17 28,20 LCD1.P$5_VDD | R13.2 47,16 | R12.2 4.3,23.9 D1.3 7.4,23.9 8.5,25 v14,25 | CN1.2 v50,21.81 | v12.5,33 v32,33
VDD2  (via drill 0.5)
  Top 0.406: IC1.4 47,52.5 C5.1 46.5,52.5 v46.5,51.5
  Bottom 0.127: 34.29,58.5 34.29,57.15 SDC.4
  Bottom 0.406: v46.5,51.5 46.5,55.5 C22.1 43.5,58.5 34.29,58.5 34,58.5 | 34,58.5 33.85,58.5 33.85,58.15 | 33.85,57.1 33.85,58.15 | 33.85,58.15 34,58.5

### Text on the board
tPlace: Fukusuke_20170725 | Wave_Clock_PIC32MX120_Mono